# Altium schematic sheet Sheet2.SchDoc
size A4
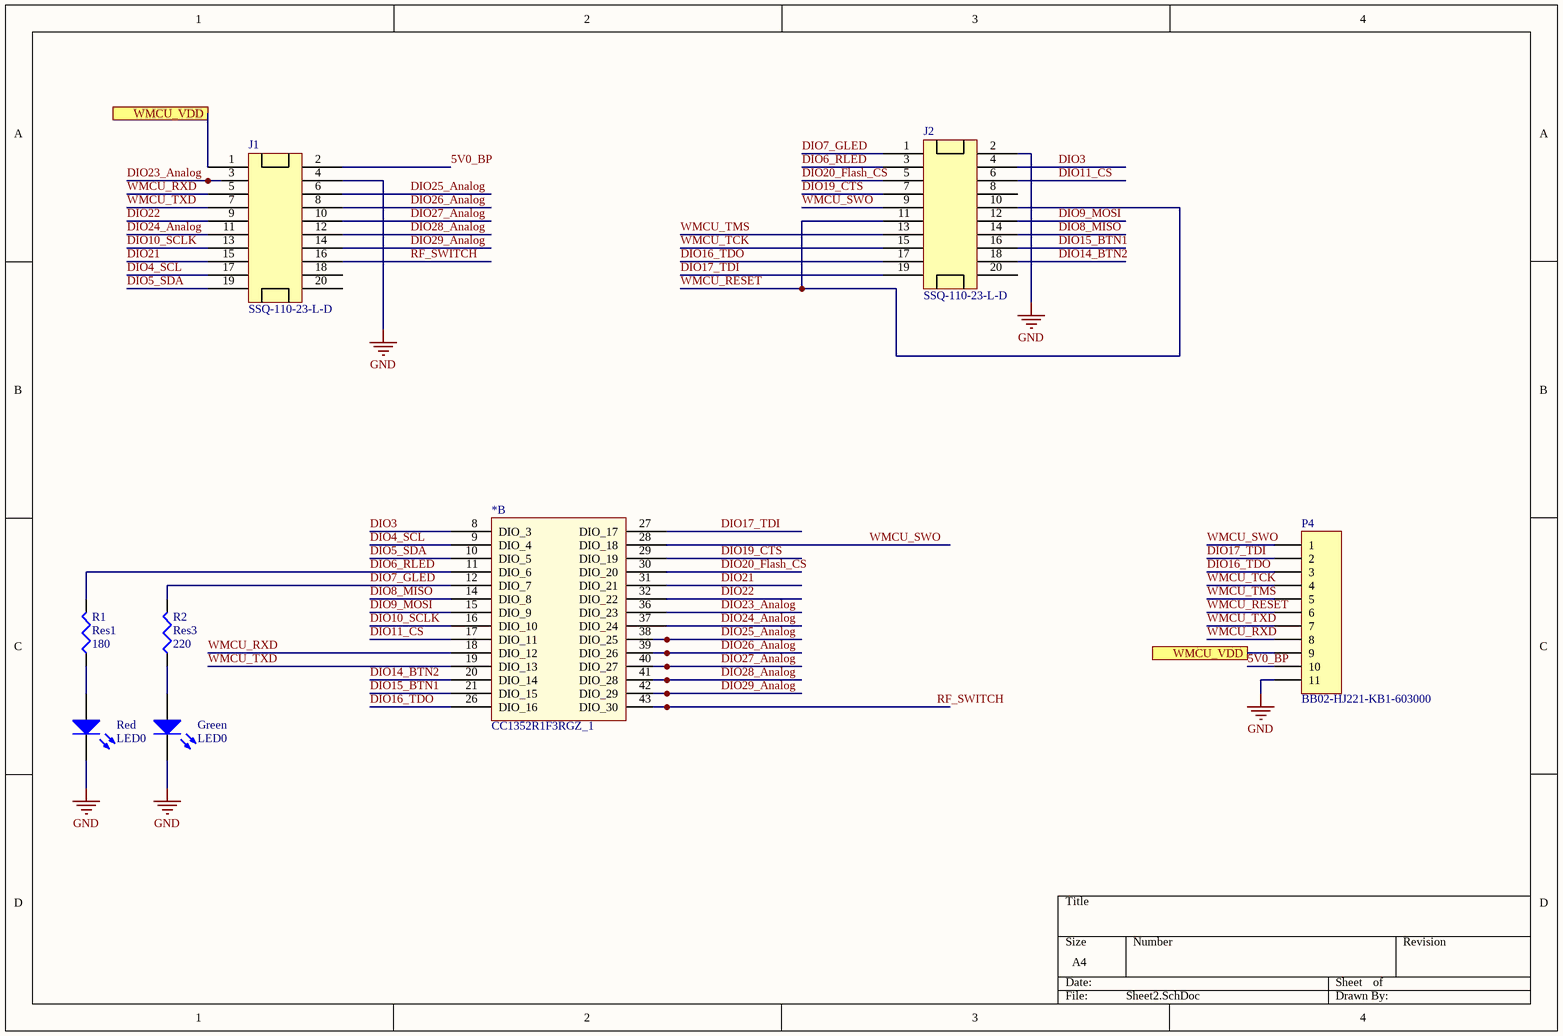
[diagram p0: Sheet2.SchDoc]

## Parts
*  CC1352R1F3RGZ_1  [CC1352R]  (part B of 2)
Green  LED0  [1206 Real]
J1  SSQ-110-23-L-D
J2  SSQ-110-23-L-D
P4  BB02-HJ221-KB1-603000  [HDR1X11]
R1  Res1  value 180  [1206 Real]
R2  Res3  value 220  [1206 Real]
Red  LED0  [1206 Real]

## Ports
WMCU_VDD

## Nets
GND: Green.2(K) J1.4 J2.2 P4.11 Red.2(K)
5V0_BP: J1.2 P4.10
DIO3: *.8(DIO_3) J2.4
DIO4_SCL: *.9(DIO_4) J1.17
DIO5_SDA: *.10(DIO_5) J1.19
DIO6_RLED: *.11(DIO_6) J2.3 R1.2
DIO7_GLED: *.12(DIO_7) J2.1 R2.2
DIO8_MISO: *.14(DIO_8) J2.14
DIO9_MOSI: *.15(DIO_9) J2.12
DIO10_SCLK: *.16(DIO_10) J1.13
DIO11_CS: *.17(DIO_11) J2.6
DIO14_BTN2: *.20(DIO_14) J2.18
DIO15_BTN1: *.21(DIO_15) J2.16
DIO16_TDO: *.26(DIO_16) J2.17 P4.3
DIO17_TDI: *.27(DIO_17) J2.19 P4.2
DIO19_CTS: *.29(DIO_19) J2.7
DIO20_Flash_CS: *.30(DIO_20) J2.5
DIO21: *.31(DIO_21) J1.15
DIO22: *.32(DIO_22) J1.9
DIO23_Analog: *.36(DIO_23) J1.3
DIO24_Analog: *.37(DIO_24) J1.11
DIO25_Analog: *.38(DIO_25) J1.6
DIO26_Analog: *.39(DIO_26) J1.8
DIO27_Analog: *.40(DIO_27) J1.10
DIO28_Analog: *.41(DIO_28) J1.12
DIO29_Analog: *.42(DIO_29) J1.14
RF_SWITCH: *.43(DIO_30) J1.16
WMCU_RESET: J2.10 J2.11 P4.6
WMCU_RXD: *.18(DIO_12) J1.5 P4.8
WMCU_SWO: *.28(DIO_18) J2.9 P4.1
WMCU_TCK: J2.15 P4.4
WMCU_TMS: J2.13 P4.5
WMCU_TXD: *.19(DIO_13) J1.7 P4.7
WMCU_VDD: J1.1 P4.9 ; port WMCU_VDD
NetGreen_1: Green.1(A) R2.1
NetR1_1: R1.1 Red.1(A)

Not connected (* = marked no-connect by the designer): J1 18 20; J2 8 20

## Library data of the parts
Green Red = LED0: Typical INFRARED GaAs LED; Published: 8-Jun-2000; LatestRevisionDate: 08-Jul-2005; LatestRevisionNote: Mech Layer 1 removed.; PackageReference: LED-0; Publisher: Altium Limited; PackageDescription: LED; 2 Leads
P4 = Header 11: Header, 11-Pin; LatestRevisionDate: 17-Jul-2002; LatestRevisionNote: Re-released for DXP Platform.; Publisher: Altium Limited
R1 R2 = Res3: Resistor; Published: 8-Jun-2000; LatestRevisionDate: 29-May-2009; LatestRevisionNote: IPC-7351 Footprint Added.; PackageReference: J1-0603; Publisher: Altium Limited; PackageDescription: Chip Resistor